# Altium project FEU31_Part1.PrjPcb
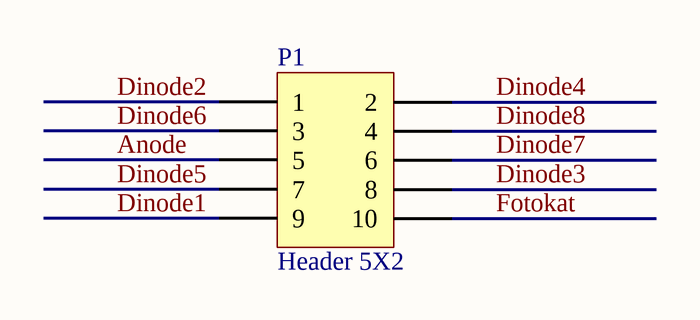
[diagram p0: FEU31_Part1.SchDoc]
1 sheet, 1 parts. Net scope: global (net labels, ports and power ports of the same name join across sheets).
Board file: FEU31_Part1.PcbDoc

## Sheet FEU31_Part1.SchDoc: Интерфейсный модуль ФЭУ-102
size A3; Address1: (с) Быканов Андрей; Address2: г.Тула 2016г.; Revision: 1.3

### Parts
P1  Header 5X2  [ФЭУ-31]

### Nets
Anode: P1.5
Dinode1: P1.9
Dinode2: P1.1
Dinode3: P1.8
Dinode4: P1.2
Dinode5: P1.7
Dinode6: P1.3
Dinode7: P1.6
Dinode8: P1.4
Fotokat: P1.10

### Notes on the sheet
- Title
- Size:
- Date:
- A3
- Number:
- Time:
- Revision:
- Sheet
- of
- File:

### Library data of the parts
P1 = Header 5X2: Header, 5-Pin, Dual row; LatestRevisionDate: 17-Jul-2002; LatestRevisionNote: Re-released for DXP Platform.; Publisher: Altium Limited